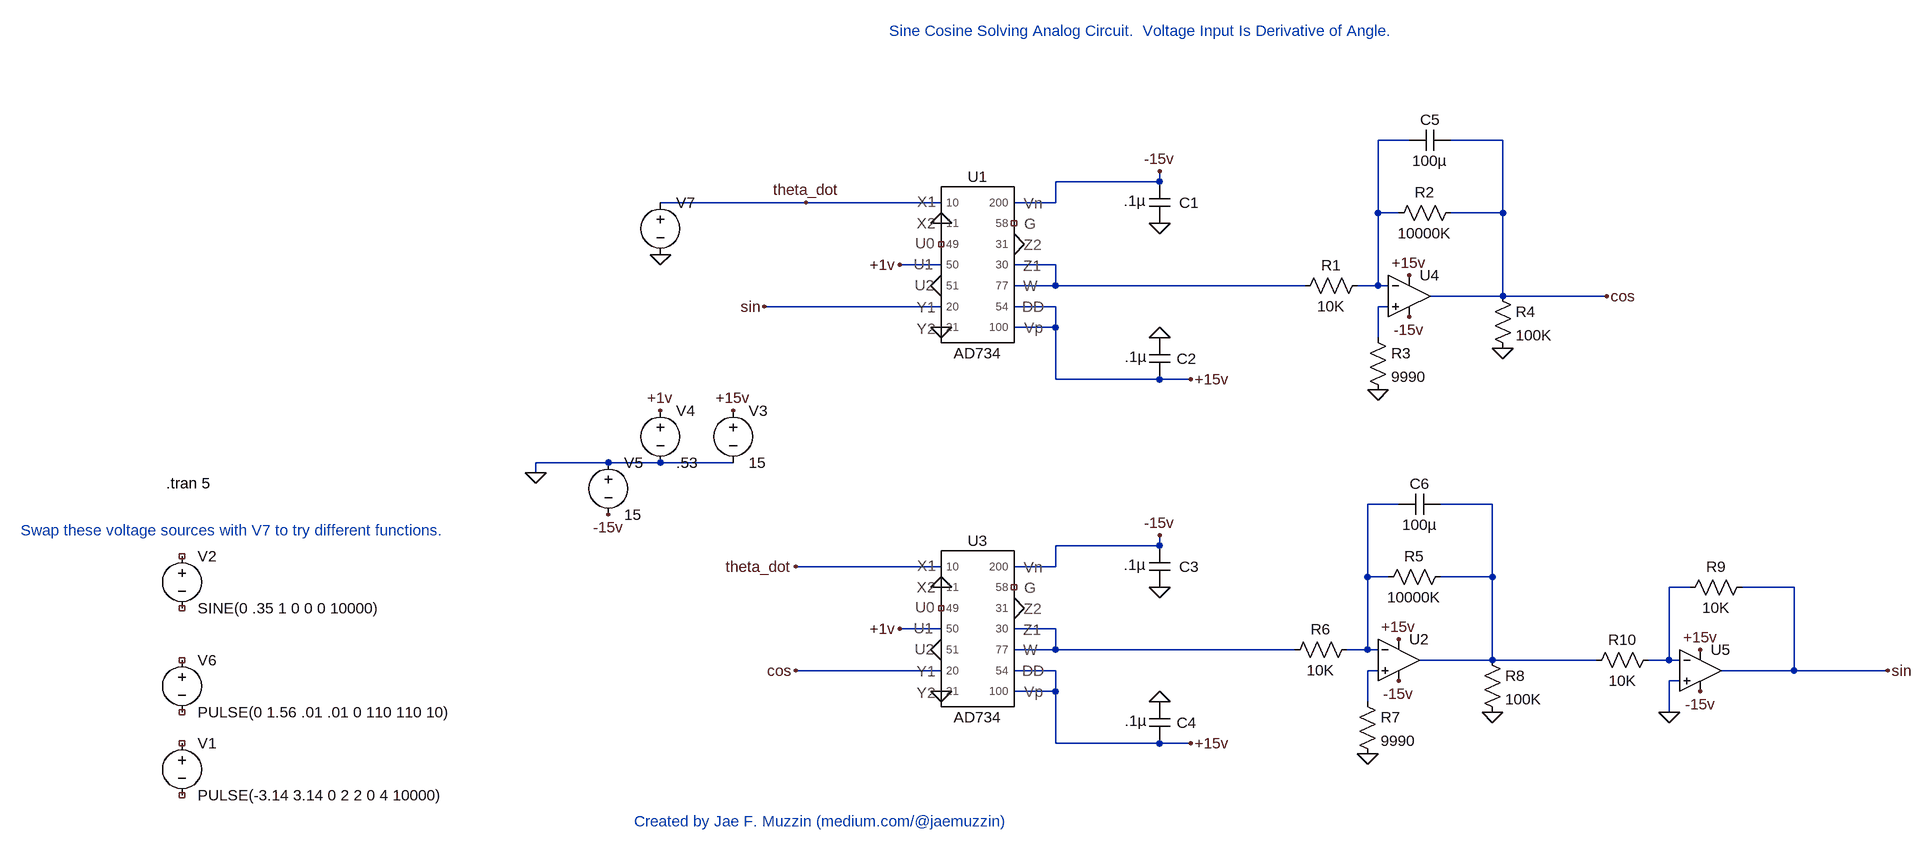
[diagram p0: schematic trig_functions.asc]
trig_functions.asc, the LTspice schematic file:
Version 4
SHEET 1 2024 1168
WIRE 880 0 832 0
WIRE 1024 0 944 0
WIRE 496 64 496 48
WIRE 496 64 336 64
WIRE -48 96 -272 96
WIRE 160 96 -48 96
WIRE 336 96 336 64
WIRE 336 96 272 96
WIRE 832 112 832 0
WIRE 864 112 832 112
WIRE 1024 112 1024 0
WIRE 1024 112 944 112
WIRE 160 192 96 192
WIRE 336 192 272 192
WIRE 336 224 336 192
WIRE 336 224 272 224
WIRE 720 224 336 224
WIRE 832 224 832 112
WIRE 832 224 800 224
WIRE 848 224 832 224
WIRE 1024 240 1024 112
WIRE 1024 240 912 240
WIRE 1184 240 1024 240
WIRE 160 256 -112 256
WIRE 336 256 272 256
WIRE 848 256 832 256
WIRE 336 288 336 256
WIRE 336 288 272 288
WIRE 832 304 832 256
WIRE 336 368 336 288
WIRE 496 368 336 368
WIRE 544 368 496 368
WIRE -352 496 -464 496
WIRE -272 496 -352 496
WIRE -160 496 -272 496
WIRE -464 512 -464 496
WIRE 864 560 816 560
WIRE 1008 560 928 560
WIRE 496 624 496 608
WIRE 496 624 336 624
WIRE 160 656 -64 656
WIRE 336 656 336 624
WIRE 336 656 272 656
WIRE 816 672 816 560
WIRE 848 672 816 672
WIRE 1008 672 1008 560
WIRE 1008 672 928 672
WIRE 1312 688 1280 688
WIRE 1472 688 1392 688
WIRE 160 752 96 752
WIRE 336 752 272 752
WIRE 336 784 336 752
WIRE 336 784 272 784
WIRE 704 784 336 784
WIRE 816 784 816 672
WIRE 816 784 784 784
WIRE 832 784 816 784
WIRE 1008 800 1008 672
WIRE 1008 800 896 800
WIRE 1168 800 1008 800
WIRE 1280 800 1280 688
WIRE 1280 800 1248 800
WIRE 1296 800 1280 800
WIRE 160 816 -64 816
WIRE 336 816 272 816
WIRE 832 816 816 816
WIRE 1472 816 1472 688
WIRE 1472 816 1360 816
WIRE 1616 816 1472 816
WIRE 1296 832 1280 832
WIRE 336 848 336 816
WIRE 336 848 272 848
WIRE 816 864 816 816
WIRE 1280 880 1280 832
WIRE 336 928 336 848
WIRE 496 928 336 928
WIRE 544 928 496 928
FLAG 496 128 0
FLAG 496 304 0
FLAG 160 128 0
FLAG 160 288 0
FLAG 496 48 -15v
FLAG 544 368 +15v
FLAG -272 176 0
FLAG -160 416 +15v
FLAG 272 160 0
FLAG 160 224 0
FLAG 96 192 +1v
FLAG -272 416 +1v
FLAG 496 688 0
FLAG 496 864 0
FLAG 160 688 0
FLAG 160 848 0
FLAG 496 608 -15v
FLAG 544 928 +15v
FLAG 272 720 0
FLAG 160 784 0
FLAG 96 752 +1v
FLAG 880 208 +15v
FLAG -464 512 0
FLAG -352 576 -15v
FLAG 880 272 -15v
FLAG 832 384 0
FLAG 864 768 +15v
FLAG 864 832 -15v
FLAG 816 944 0
FLAG 1328 784 +15v
FLAG 1328 848 -15v
FLAG 1280 880 0
FLAG -48 96 theta_dot
FLAG -64 656 theta_dot
FLAG 1616 816 sin
FLAG -64 816 cos
FLAG -112 256 sin
FLAG 1184 240 cos
FLAG 1008 880 0
FLAG 1024 320 0
SYMBOL AutoGenerated\\AD734 208 192 R0
SYMATTR InstName U1
SYMBOL cap 480 64 R0
WINDOW 0 46 32 Left 2
WINDOW 3 -39 29 Left 2
SYMATTR InstName C1
SYMATTR Value .1µ
SYMBOL cap 480 304 R0
WINDOW 0 42 32 Left 2
WINDOW 3 -38 29 Left 2
SYMATTR InstName C2
SYMATTR Value .1µ
SYMBOL voltage -1008 912 R0
WINDOW 123 0 0 Left 0
WINDOW 39 0 0 Left 0
SYMATTR InstName V1
SYMATTR Value PULSE(-3.14 3.14 0 2 2 0 4 10000)
SYMBOL voltage -160 400 R0
WINDOW 123 0 0 Left 0
WINDOW 39 0 0 Left 0
SYMATTR InstName V3
SYMATTR Value 15
SYMBOL voltage -272 400 R0
WINDOW 123 0 0 Left 0
WINDOW 39 0 0 Left 0
SYMATTR InstName V4
SYMATTR Value .53
SYMBOL AutoGenerated\\AD734 208 752 R0
SYMATTR InstName U3
SYMBOL cap 480 624 R0
WINDOW 0 46 32 Left 2
WINDOW 3 -39 29 Left 2
SYMATTR InstName C3
SYMATTR Value .1µ
SYMBOL cap 480 864 R0
WINDOW 0 42 32 Left 2
WINDOW 3 -38 29 Left 2
SYMATTR InstName C4
SYMATTR Value .1µ
SYMBOL OpAmps\\UniversalOpAmp 880 240 R0
SYMATTR InstName U4
SYMBOL res 960 96 R90
WINDOW 0 0 56 VBottom 2
WINDOW 3 32 56 VTop 2
SYMATTR InstName R2
SYMATTR Value 10000K
SYMBOL cap 944 -16 R90
WINDOW 0 0 32 VBottom 2
WINDOW 3 32 32 VTop 2
SYMATTR InstName C5
SYMATTR Value 100µ
SYMBOL voltage -352 480 R0
WINDOW 123 0 0 Left 0
WINDOW 39 0 0 Left 0
SYMATTR InstName V5
SYMATTR Value 15
SYMBOL res 816 208 R90
WINDOW 0 0 56 VBottom 2
WINDOW 3 32 56 VTop 2
SYMATTR InstName R1
SYMATTR Value 10K
SYMBOL res 816 288 R0
SYMATTR InstName R3
SYMATTR Value 9990
SYMBOL OpAmps\\UniversalOpAmp 864 800 R0
SYMATTR InstName U2
SYMBOL res 944 656 R90
WINDOW 0 0 56 VBottom 2
WINDOW 3 32 56 VTop 2
SYMATTR InstName R5
SYMATTR Value 10000K
SYMBOL cap 928 544 R90
WINDOW 0 0 32 VBottom 2
WINDOW 3 32 32 VTop 2
SYMATTR InstName C6
SYMATTR Value 100µ
SYMBOL res 800 768 R90
WINDOW 0 0 56 VBottom 2
WINDOW 3 32 56 VTop 2
SYMATTR InstName R6
SYMATTR Value 10K
SYMBOL res 800 848 R0
SYMATTR InstName R7
SYMATTR Value 9990
SYMBOL OpAmps\\UniversalOpAmp 1328 816 R0
SYMATTR InstName U5
SYMBOL res 1408 672 R90
WINDOW 0 0 56 VBottom 2
WINDOW 3 32 56 VTop 2
SYMATTR InstName R9
SYMATTR Value 10K
SYMBOL res 1264 784 R90
WINDOW 0 0 56 VBottom 2
WINDOW 3 32 56 VTop 2
SYMATTR InstName R10
SYMATTR Value 10K
SYMBOL res 1008 224 R0
SYMATTR InstName R4
SYMATTR Value 100K
SYMBOL res 992 784 R0
SYMATTR InstName R8
SYMATTR Value 100K
SYMBOL voltage -1008 784 R0
WINDOW 123 0 0 Left 0
WINDOW 39 0 0 Left 0
SYMATTR InstName V6
SYMATTR Value PULSE(0 1.56 .01 .01 0 110 110 10)
SYMBOL voltage -272 80 R0
WINDOW 123 0 0 Left 0
WINDOW 39 0 0 Left 0
WINDOW 3 24 96 Invisible 2
SYMATTR InstName V7
SYMATTR Value PULSE(-1.54 +1.54 0 .01 .01 .998 2 20)
SYMBOL voltage -1008 624 R0
WINDOW 123 0 0 Left 0
WINDOW 39 0 0 Left 0
SYMATTR InstName V2
SYMATTR Value SINE(0 .35 1 0 0 0 10000)
TEXT -1032 528 Left 2 !.tran 5
TEXT -1256 600 Left 2 ;Swap these voltage sources with V7 to try different functions.
TEXT -312 1048 Left 2 ;Created by Jae F. Muzzin (medium.com/@jaemuzzin)
TEXT 80 -168 Left 2 ;Sine Cosine Solving Analog Circuit.  Voltage Input Is Derivative of Angle.

The netlist it stands for:
* trig_functions.asc
XU1 theta_dot 0 NC_01 +1v 0 sin 0 -15v NC_02 0 N002 N002 +15v +15v AD734  ; pins 10 11 49 50 51 20 21 200 58 31 30 77 54 100
C1 -15v 0 .1µ
C2 0 +15v .1µ
V1 NC_03 NC_04 PULSE(-3.14 3.14 0 2 2 0 4 10000)
V3 +15v 0 15
V4 +1v 0 .53
XU3 theta_dot 0 NC_05 +1v 0 cos 0 -15v NC_06 0 N007 N007 +15v +15v AD734  ; pins 10 11 49 50 51 20 21 200 58 31 30 77 54 100
C3 -15v 0 .1µ
C4 0 +15v .1µ
XU4 N003 N001 +15v -15v cos level1 Avol=1Meg GBW=10Meg Vos=0 En=0 Enk=0 In=0 Ink=0 Rin=500Meg  ; pins In+ In- V+ V- OUT
R2 cos N001 10000K
C5 cos N001 100µ
V5 0 -15v 15
R1 N001 N002 10K
R3 N003 0 9990
XU2 N008 N004 +15v -15v N005 level1 Avol=1Meg GBW=10Meg Vos=0 En=0 Enk=0 In=0 Ink=0 Rin=500Meg  ; pins In+ In- V+ V- OUT
R5 N005 N004 10000K
C6 N005 N004 100µ
R6 N004 N007 10K
R7 N008 0 9990
XU5 0 N006 +15v -15v sin level1 Avol=1Meg GBW=10Meg Vos=0 En=0 Enk=0 In=0 Ink=0 Rin=500Meg  ; pins In+ In- V+ V- OUT
R9 sin N006 10K
R10 N006 N005 10K
R4 cos 0 100K
R8 N005 0 100K
V6 NC_07 NC_08 PULSE(0 1.56 .01 .01 0 110 110 10)
V7 theta_dot 0 PULSE(-1.54 +1.54 0 .01 .01 .998 2 20)
V2 NC_09 NC_10 SINE(0 .35 1 0 0 0 10000)
.tran 5
* Swap these voltage sources with V7 to try different functions.
* Created by Jae F. Muzzin (medium.com/@jaemuzzin)
* Sine Cosine Solving Analog Circuit.  Voltage Input Is Derivative of Angle.
.lib C:\Users\Admin\Downloads\ad734.cir
.lib UniversalOpAmp1.lib
.backanno
.end